# EAGLE schematic PCB-SDCARD (EAGLE 6.5.0)
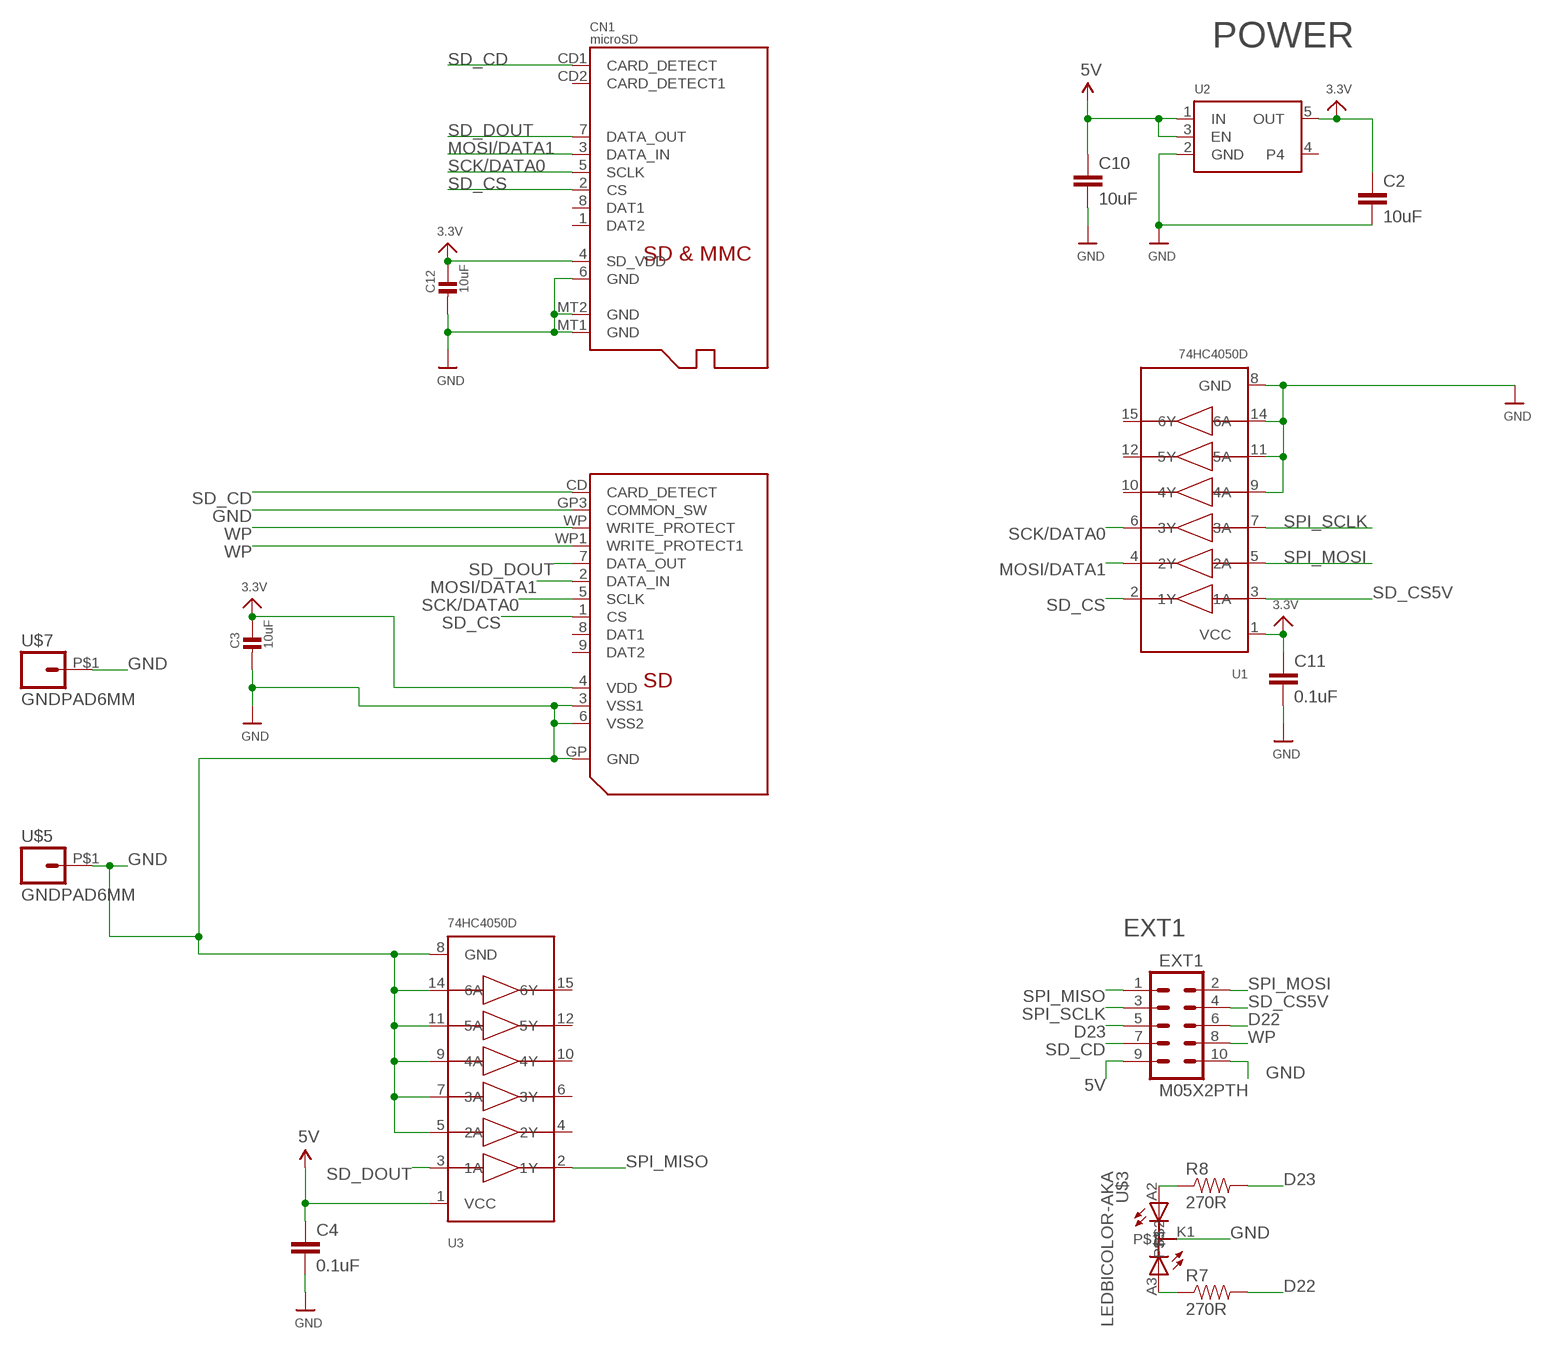
[diagram p0: schematic, sheet 1]

## Parts
C2  10uF  CAP0805  [0805]
C3  10uF  CAP_CERAMIC0805  [0805]
C4  0.1uF  CAP0603-CAP  [0603-CAP]
C10  10uF  CAP0805  [0805]
C11  0.1uF  CAP0603-CAP  [0603-CAP]
C12  10uF  CAP_CERAMIC0805  [0805]
CN1  microSD  MICROSD  [MICROSD]
EXT1  M05X2PTH  [AVR_ICSP]
R7  270R  RESISTOR0603-RES  [0603-RES]
R8  270R  RESISTOR0603-RES  [0603-RES]
U1  74HC4050D  74HC4050DTSSOP16  [TSSOP16]
U2  VREG_SOT23-5  [SOT23-5]
U3  74HC4050D  74HC4050DTSSOP16  [TSSOP16]
U$2  SD06132  [SD_LARGE]
U$3  LEDBICOLOR-AKA  [LED5MM-BICOLOR]
U$5  GNDPAD6MM  [3.2MMPAD6MM]
U$7  GNDPAD6MM  [3.2MMPAD6MM]

## Nets
3.3V [Power]: C2.1 C3.1 C11.1 C12.1 CN1.4(SD_VDD) U1.1(VCC) U2.5(OUT) U$2.4(VDD)
5V [Power]: C4.1 C10.1 EXT1.9 U2.1(IN) U2.3(EN) U3.1(VCC)
D22: EXT1.6 R7.2
D23: EXT1.5 R8.2
GND [Power]: C2.2 C3.2 C4.2 C10.2 C11.2 C12.2 CN1.6(GND) CN1.MT1(GND) CN1.MT2(GND) EXT1.10 U1.8(GND) U1.9(4A) U1.11(5A) U1.14(6A) U2.2(GND) U3.5(2A) U3.7(3A) U3.8(GND) U3.9(4A) U3.11(5A) U3.14(6A) U$2.3(VSS1) U$2.6(VSS2) U$2.GP3(COMMON_SW) U$2.GP(GND) U$3.K1 U$5.P$1 U$7.P$1
MOSI/DATA1: CN1.3(DATA_IN) U1.4(2Y) U$2.2(DATA_IN)
N$17: R8.1 U$3.A2
N$22: R7.1 U$3.A3
SCK/DATA0: CN1.5(SCLK) U1.6(3Y) U$2.5(SCLK)
SD_CD: CN1.CD1(CARD_DETECT) EXT1.7 U$2.CD(CARD_DETECT)
SD_CS: CN1.2(CS) U1.2(1Y) U$2.1(CS)
SD_CS5V: EXT1.4 U1.3(1A)
SD_DOUT: CN1.7(DATA_OUT) U3.3(1A) U$2.7(DATA_OUT)
SPI_MISO: EXT1.1 U3.2(1Y)
SPI_MOSI: EXT1.2 U1.5(2A)
SPI_SCLK: EXT1.3 U1.7(3A)
WP: EXT1.8 U$2.WP1(WRITE_PROTECT1) U$2.WP(WRITE_PROTECT)
Unconnected: CN1.1(DAT2) CN1.8(DAT1) CN1.CD2(CARD_DETECT1) U1.10(4Y) U1.12(5Y) U1.15(6Y) U2.4 U3.4(2Y) U3.6(3Y) U3.10(4Y) U3.12(5Y) U3.15(6Y) U$2.8(DAT1) U$2.9(DAT2)

## Notes on the sheet
- POWER
- EXT1

## Library data of the parts
C2 C4 C10 C11 = SparkFun:CAP: Capacitor Standard 0603 ceramic capacitor, and 0.1" leaded capacitor.
C3 C12 = microbuilder:CAP_CERAMIC: Ceramic Capacitors For new designs, use the packages preceded by an '_' character since they are more reliable: The following footprints should be used on most boards: _0402 - Standard footprint for regular board layouts _0603 - Standard footprint for regular board layouts _0805 - Standard footprint for regular board layouts For extremely tight-pitch boards where space is at a premium, the following 'micro-pitch' footprints can be used (smaller pads, no silkscreen outline, etc.): _0402MP - Micro-pitch footprint for very dense/compact boards _0603MP - Micro-pitch footprint for very dense/compact boards _0805MP - Micro-pitch footprint for very dense/compact boards Commonly Stocked Parts 0402 - 0402 Surface Mount Capacitors 16pF 50V 5% [Digikey: 445-4899-2-ND] 18pF 50V 5% [Digikey: 490-1281-2-ND] 22pF 50V 5% [Digikey: 490-1283-2-ND] 68pF 50V 5% [Digikey: 490-1289-2-ND] 0.1uF 10V 10% [Digikey: 490-1318-2-ND] 1.0uF 6.3V 10% [Digikey: 490-1320-2-ND] 0603 - 0603 Surface Mount Capacitors 16 pF 50V 5% [Digikey: 445-5051-2-ND] 22 pF 50V [Digikey: PCC220ACVTR-ND] 33 pF 50V 5% [Digikey: 490-1415-1-ND] 56pF 50V 5% [Digikey: 490-1421-1-ND] 220pF 50V 5% [Digikey: 445-1285-1-ND] 680 pF 50V 2200 pF 50V 5% C0G [Digikey: 445-1297-1-ND] 5600 pF 100V 5% X7R [Digikey: 478-3711-1-ND] 0.1 µF 25V 10% [Digikey: PCC2277TR-ND] 0.22 µF 16V 10% X7R [Digikey: 445-1318-1-ND] 1.0 µF 25V 10% [Digikey: 445-5146-2-ND] 0603 - RF Specific 3pF 250V +/-0.1pF RF [Digikey: 712-1347-1-ND] 18 pF 250V 5% [Digikey: 478-3505-1-ND or 712-1322-1-ND] 56 pF 250V 5% C0G RF [Digikey: 490-4867-1-ND] 68 pF 250V RF [Digikey: 490-4868-1-ND] 0805 - 0805 Surface Mount Capacitors 220 pF 250V 2% RF Ceramic Capacitor [Digikey: 712-1398-1-ND] 1000 pF 50V 2% NP0 Ceramic Capacitor [Digikey: 478-3760-1-ND] 0.1 µF 25V 10% Ceramic Capacitor [Digikey: PCC1828TR-ND] 1.0 µF 16V 10% Ceramic Capacitor[Digikey: 490-1691-2-ND] 10.0 µF 10V 10% Ceramic Capacitor[Digikey: 709-1228-1-ND] 10.0 uF 16V 10% Ceramic Capacitor [Digikey: 478-5165-2-ND] 47 uF 6.3V 20% Ceramic Capacitor [Digikey: 587-1779-1-ND or 399-5506-1-ND] 1206 - 1206 Surface Mount Capacitors 47uF 10V 20% Ceramic Capacitor [Digikey: 490-5528-1-ND or 399-5508-1-ND or 445-6010-1-ND] 100uF 6.3V -20%, +80% Y5V Ceramic Capacitor (Digikey: 490-4512-1-ND, Mouser: 81-GRM31CF50J107ZE1L)
CN1 = microbuilder:MICROSD: MicroSD/Transflash Card Holder with SPI pinout 3M: 2908-05WB-MG 4UConnector: 19656 Footprint courtesy: Adafruit Industries
EXT1 = SparkFun:M05X2: Header 5x2 Standard 10-pin dual row 0.1" header. Commonly used with AVR-ISP. Use with Spark Fun Electronics SKU: PRT-00778
R7 R8 = SparkFun:RESISTOR: Resistor Basic schematic elements and footprints for 0603, 1206, and PTH resistors.
U1 U3 = SKAARHOJ:74HC4050D: 6-channel level shifter 74HC4050D - 2V-6V Supply Digikey: 74HC4050D,653-ND Mouser: 771-74HC4050D-T
U2 = microbuilder:VREG_SOT23-5: SOT23-5 Fixed Voltage Regulators Part Current Out V Out V In V Dropout θJA (°C/W) TJ (°C) Digikey Part No. ADP121 150mA 3.3V 3.4-5.5V 0.09V @ 150mA -- -- ADP121-AUJZ33R7CT-ND ADP121 150mA 3.0V 3.1-5.5V 0.09V @ 150mA -- -- ADP121-AUJZ30R7CT-ND ADP122 300mA 3.3V 3.4-5.5V 0.085V @ 300mA -- -- ADP122AUJZ-3.3-R7CT-ND ADP1712 300mA 3.3V 3.5-5.5V 0.17V @ 300mA -- -- ADP1712AUJZ-3.3-R7TR-ND AP7311 (Low Cost) 150mA 3.3V 3.5-6V 0.15V @ 150mA -- -- AP7311-33WG-7DICT-ND LD39015M18R 150mA 1.8V 1.9V-5.5V 0.08V @ 100mA -- -- 497-6977-1-ND LP2985A-33DBVR 150mA 3.3V 3.3-16V 0.28V @ 150mA 206 150 296-18479-1-ND MCP1824T-3302E/OT 300mA 3.3V 3.5V-6V 0.2V @ 300mA -- -- MCP1824T-3302E/OTCT-ND MIC5205-2.5YM5 TR 150mA 2.5V 2.7-16V 0.165V @ 150mA -- -- 576-1257-2-ND MIC5205-3.0YM5 TR 150mA 3.0V 3.2V-16V 0.165V @ 150mA -- -- 576-1258-2-ND MIC5205-3.3YM5 TR 150mA 3.3V 3.5V-16V 0.165V @ 150mA -- -- 576-1259-2-ND TPS780330220 150mA 3.3V+2.2V 3.6-5.5V 250mV Max -- -- 296-23332-1-ND TDA3663/N1,135 100mA 3.3V 3.5-45V 0.18V @ 50mA -- -- 568-5343-1-ND Max operating temp can be calculated using θJA, TJ (max junction temperature), and power in watts. Set the "Maximum Ambient Temperature" until it reaches TJ ("Max Junction Temperature"), which is the absolute limit for safe use of the regulator: Heat Sink Temperature Calculator <http://www.daycounter.com/Calculators/Heat-Sink-Temperature-Calculator.phtml> For example, With 12V source into a 3.3V LP2985 and a 30mA load, we are dissipating (12V-3.3V) * 0.03A = 0.261W. With a θJA of 206 °C/W, a TJ of 150°C, and 261mW we can safely use the chip without a heat sink up to 75°C (=147.1°C Junction Temperature).
U$2 = SKAARHOJ:SD: SD MMC Card holder 4UCON part #06132 - easy to solder
U$3 = SKAARHOJ:LEDBICOLOR-AKA
U$5 U$7 = SKAARHOJ:GNDPAD

## Net classes
0 default: width 0.254 mm, drill 0.406 mm, clearance 0.254 mm
1 Power: width 0.406 mm, drill 0.61 mm, clearance 0.254 mm